# Altium schematic sheet OpAmp_K-5.SchDoc
size A4; SheetNumber: 9; SheetTotal: 9
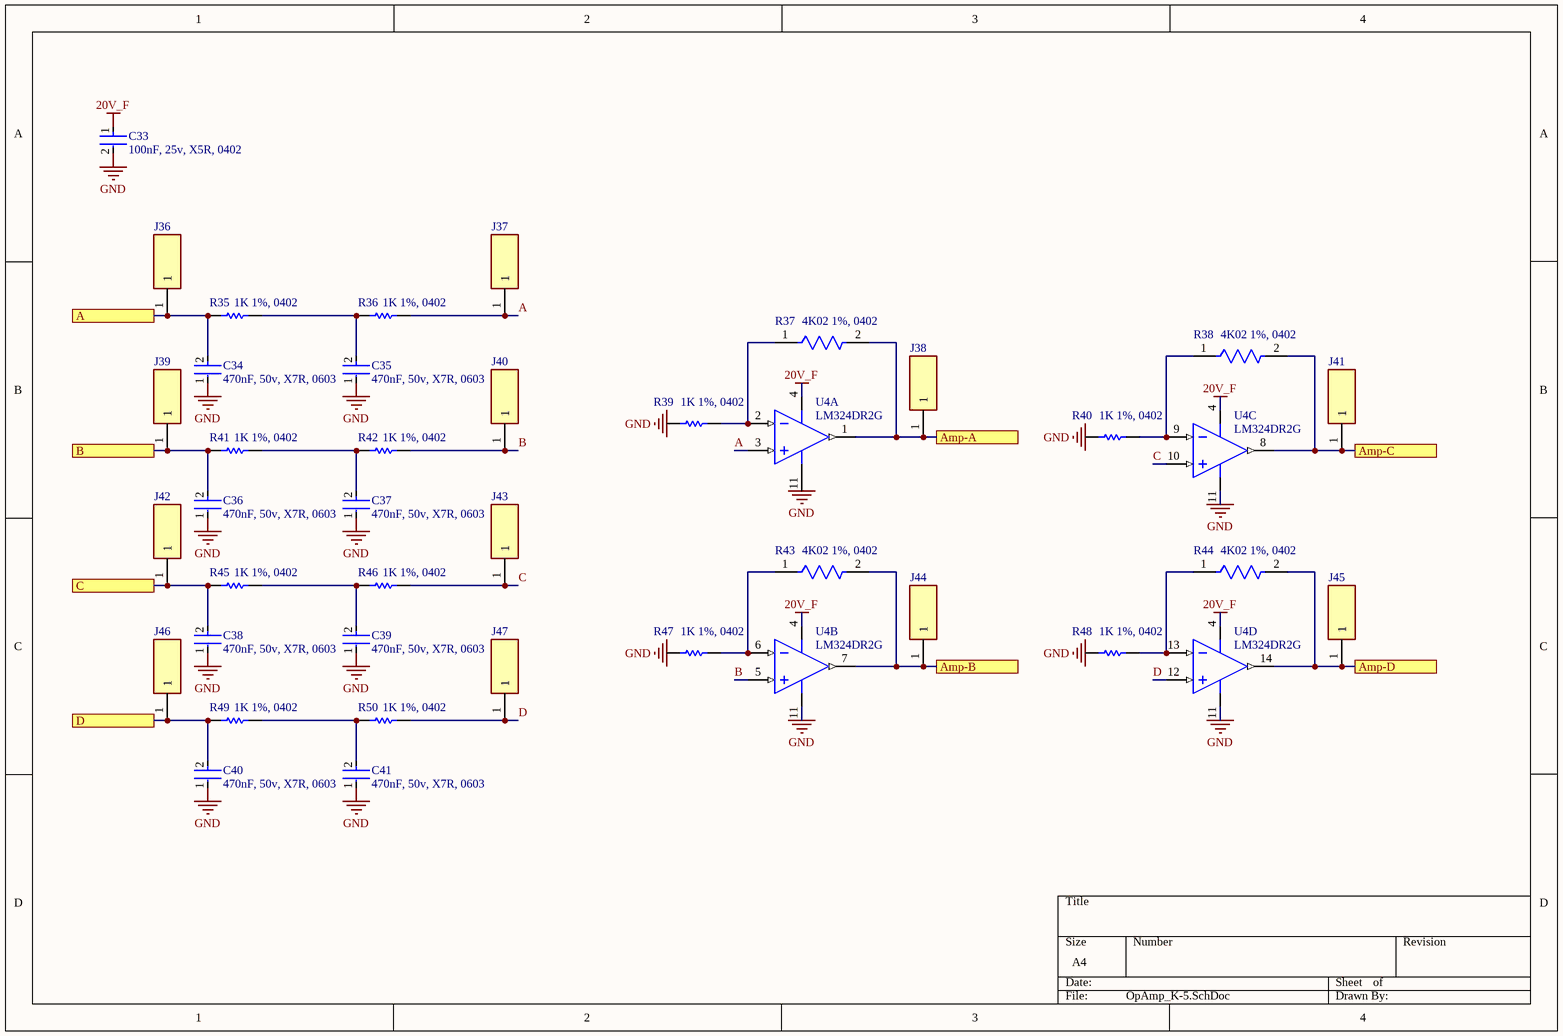
[diagram p0: OpAmp_K-5.SchDoc]

## Parts
C33  100nF, 25v, X5R, 0402  [FP-GRM155-0_05-IPC_C]
C34  470nF, 50v, X7R, 0603  [FP-C1608-080-0_1-IPC_C]
C35  470nF, 50v, X7R, 0603  [FP-C1608-080-0_1-IPC_C]
C36  470nF, 50v, X7R, 0603  [FP-C1608-080-0_1-IPC_C]
C37  470nF, 50v, X7R, 0603  [FP-C1608-080-0_1-IPC_C]
C38  470nF, 50v, X7R, 0603  [FP-C1608-080-0_1-IPC_C]
C39  470nF, 50v, X7R, 0603  [FP-C1608-080-0_1-IPC_C]
C40  470nF, 50v, X7R, 0603  [FP-C1608-080-0_1-IPC_C]
C41  470nF, 50v, X7R, 0603  [FP-C1608-080-0_1-IPC_C]
J36  TestPad  [TestPad]  (value not drawn)  (no BOM)
J37  TestPad  [TestPad]  (value not drawn)  (no BOM)
J38  TestPad  [TestPad]  (value not drawn)  (no BOM)
J39  TestPad  [TestPad]  (value not drawn)  (no BOM)
J40  TestPad  [TestPad]  (value not drawn)  (no BOM)
J41  TestPad  [TestPad]  (value not drawn)  (no BOM)
J42  TestPad  [TestPad]  (value not drawn)  (no BOM)
J43  TestPad  [TestPad]  (value not drawn)  (no BOM)
J44  TestPad  [TestPad]  (value not drawn)  (no BOM)
J45  TestPad  [TestPad]  (value not drawn)  (no BOM)
J46  TestPad  [TestPad]  (value not drawn)  (no BOM)
J47  TestPad  [TestPad]  (value not drawn)  (no BOM)
R35  1K 1%, 0402  [RESC1005X40X25NL05T05]
R36  1K 1%, 0402  [RESC1005X40X25NL05T05]
R37  4K02 1%, 0402  [FP-ERJ2RK-IPC_A]
R38  4K02 1%, 0402  [FP-ERJ2RK-IPC_A]
R39  1K 1%, 0402  [RESC1005X40X25NL05T05]
R40  1K 1%, 0402  [RESC1005X40X25NL05T05]
R41  1K 1%, 0402  [RESC1005X40X25NL05T05]
R42  1K 1%, 0402  [RESC1005X40X25NL05T05]
R43  4K02 1%, 0402  [FP-ERJ2RK-IPC_A]
R44  4K02 1%, 0402  [FP-ERJ2RK-IPC_A]
R45  1K 1%, 0402  [RESC1005X40X25NL05T05]
R46  1K 1%, 0402  [RESC1005X40X25NL05T05]
R47  1K 1%, 0402  [RESC1005X40X25NL05T05]
R48  1K 1%, 0402  [RESC1005X40X25NL05T05]
R49  1K 1%, 0402  [RESC1005X40X25NL05T05]
R50  1K 1%, 0402  [RESC1005X40X25NL05T05]
U4  LM324DR2G  [ONSC-SOIC-14-751A-03_V]  (parts A,B,C,D of 4)

## Ports
A (see PowerModule[4A]), Amp-A (see PowerModule[4A]), Amp-B (see PowerModule[4A]), Amp-C (see PowerModule[4A]), Amp-D (see PowerModule[4A]), B (see PowerModule[4A]), C (see PowerModule[4A]), D (see PowerModule[4A])

## Nets
20V_F: C33.1 U4.4(VCC)
GND: C33.2 C34.1 C35.1 C36.1 C37.1 C38.1 C39.1 C40.1 C41.1 R39.2 R40.2 R47.2 R48.2 U4.11(VEE/GND)
A: J37.1 R36.1 U4.3(IN1+)
A: C34.2 J36.1 R35.2 ; port A  [a separate net that carries the same name]
Amp-A: J38.1 R37.2 U4.1(OUT1) ; port Amp-A
Amp-B: J44.1 R43.2 U4.7(OUT2) ; port Amp-B
Amp-C: J41.1 R38.2 U4.8(OUT3) ; port Amp-C
Amp-D: J45.1 R44.2 U4.14(OUT4) ; port Amp-D
B: J40.1 R42.1 U4.5(IN2+)
B: C36.2 J39.1 R41.2 ; port B  [a separate net that carries the same name]
C: J43.1 R46.1 U4.10(IN3+)
C: C38.2 J42.1 R45.2 ; port C  [a separate net that carries the same name]
D: J47.1 R50.1 U4.12(IN4+)
D: C40.2 J46.1 R49.2 ; port D  [a separate net that carries the same name]
NetC35_2: C35.2 R35.1 R36.2
NetC37_2: C37.2 R41.1 R42.2
NetC39_2: C39.2 R45.1 R46.2
NetC41_2: C41.2 R49.1 R50.2
NetR37_1: R37.1 R39.1 U4.2(IN1-)
NetR38_1: R38.1 R40.1 U4.9(IN3-)
NetR43_1: R43.1 R47.1 U4.6(IN2-)
NetR44_1: R44.1 R48.1 U4.13(IN4-)

## Notes on the sheet
- Labels drawn without touching a wire or pin: GND

## Library data of the parts
C33 = CMP-06035-003661-1: Chip Multilayer Ceramic Capacitors for General Purpose, 0402, 0.10uF, X7R, 15%, 10%, 25V; Length: 1mm; Depth: 0.5mm; Dielectric: X7R; Voltage Rating: 25V; Lead Free: Lead Free; Case Code (Imperial): 0402; Voltage: 25V; Min Operating Temperature: -55°C; Tolerance: 10%; Dielectric Material: Ceramic; Voltage Rating (DC): 25V; Max Operating Temperature: 125°C; Capacitance: 100nF; Thickness: 0.022inch; Case/Package: 0402; Height: 0.5mm; Resistor Type: Ceramic; Weight: 0.000212oz; Case Code (Metric): 1005; Package Quantity: 10000; Termination: SMD/SMT; Width: 0.02inch; Mount: Surface Mount; Packaging: Tape and Reel
C34-C41 = CMP-08246-003628-1: Multilayer Ceramic Capacitors 470nF ±10% 50V X7R SMD 0603; Resistor Type: Ceramic; Radiation Hardening: No; Termination: SMD/SMT; Min Operating Temperature: -55°C; RoHS Compliant: Yes; Length: 1.6mm; Package Quantity: 4000; Tolerance: 10%; Packaging: Cut Tape; Max Operating Temperature: 125°C; Series: C; Thickness: 0.037inch; Voltage Rating (DC): 50V; Mount: Surface Mount; Weight: 7.1E-05oz; Dielectric: X7R; Case/Package: 0603; Construction: Flat; Height: 0.8mm; Capacitance: 470nF; Case Code (Metric): 1608; Voltage: 50V; Dielectric Material: Ceramic; Voltage Rating: 50V; Depth: 0.8mm; Lead Free: Lead Free; REACH SVHC: No SVHC; Width: 0.031inch; Case Code (Imperial): 0603
J36-J47 = 61300111121: Connector; Manufacturer_Name: Wurth Elektronik; Datasheet Link: https://katalog.we-online.de/em/datasheet/6130xx11121.pdf; Height: 8.89mm; Manufacturer_Part_Number: 61300111121; Mouser Part Number: 710-61300111121; Mouser Price/Stock: https://www.mouser.co.uk/ProductDetail/Wurth-Elektronik/61300111121?qs=PhR8RmCirEaRH5Ck%252B2lRLQ%3D%3D
R35 R36 R39-R42 R45-R50 = CMP-1011-00510-4: Chip Resistor, 1 KOhm, +/- 1%, 100 mW, -55 to 155 degC, 0402 (1005 Metric), RoHS, Tape and Reel; PartNumber: ERJ-2RKF1001X; Manufacturer: Basic Passives; Voltage Rating: 50 V; Case\/Package: 0402; Resistance: 1 KOhm; Power Rating: 100 mW; DatasheetVersion: 04/2015; Radiation Hardening: No; Pins: 2; Height: 0.35 mm; RoHSCompliant: true; Case Code (Imperial): 0402; ComponentLink2Description: Datasheet; ComponentLink1Description: Manufacturer URL; PackageReference: 0402; Mount: Surface Mount; Package Quantity: 10000; Tolerance: 1%; ComponentLink1URL: http://www.panasonic.com/; PackageDescription: 2-Pin Surface Mount Device, Body 1 x 0.5 mm; Mounting Technology: Surface Mount; Case Code (Metric): 1005; ComponentLink2URL: http://industrial.panasonic.com/cdbs/www-data/pdf/RDA0000/AOA0000C86.pdf; REACH SVHC: Yes; Packaging: Tape and Reel; Max Operating Temperature: 155 degC; Min Operating Temperature: -55 degC; Width: 0.5 mm; Length: 1 mm
R37 R38 R43 R44 = CMP-2002-00918-2: RES SMD 4.02K OHM 1% 1/10W 0402; Voltage Rating: 50V; Power Rating: 100mW; Temperature Coefficient: 100ppm/°C; Resistance: 4.02kR; Contact Plating: Tin; Technology: THICK FILM; Construction: Rectangular; Case Code (Imperial): 0402; Resistance Tolerance: 1%; Series: ERJ; Military Standard: Not; RoHS Compliant: Yes; Width: 0.02inch; Package Quantity: 1; Mount: Surface Mount; Voltage Rating (DC): 50V; Number of Terminations: 2; Case Code (Metric): 1005; Height: 0.35mm; Resistor Type: Thick Film; Features: Automotive AEC-Q200; Length: 1mm; Tolerance: 1%; Case/Package: 0402; Max Operating Temperature: 155°C; Min Operating Temperature: -55°C; Max Power Dissipation: 100mW; Lead Free: Lead Free; Packaging: Tape and Reel; Depth: 0.5mm; Termination: SMD/SMT
U4 = CMP-1310-00171-1: Single Supply Quad Operational Amplifier, 3 to 32 V, 0 to 70 degC, 14-Pin SOIC, Pb-Free, Tape and Reel; Manufacturer: On Semiconductor; VCC Max (V): 32; VCC Min (V): 3; PackageVersion: Rev. K, 05/2011; ComponentLink3URL: http://www.onsemi.com/pub_link/Collateral/751A-03.PDF; ComponentLink3Description: Package Specification; Packing: Tape and Reel; ComponentLink2URL: http://www.onsemi.cn/pub_link/Collateral/LM324-D.PDF; PackageReference: SOIC-14-751A-03; ComponentLink1URL: http://www.onsemi.com/; PackageDescription: 14-Pin Small Outline Integrated Circuit, Body 8.65 x 3.9 mm, Pitch 1.27 mm; ComponentLink1Description: Manufacturer URL; DatasheetVersion: Rev. 25; Mounting Technology: Surface Mount; RoHS: TRUE; ComponentLink2Description: Datasheet; PartNumber: LM324DR2G